# Altium schematic sheet watch_1v1_connector_breakout.SchDoc
size A
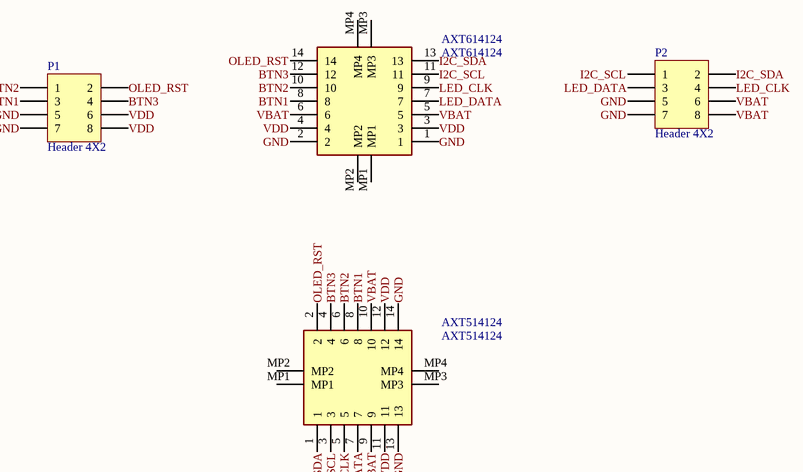
[diagram p0: watch_1v1_connector_breakout.SchDoc]

## Parts
AXT514124  AXT514124  [AXT514124]
AXT614124  AXT614124  [AXT614124]
P1  Header 4X2  [HDR2X4]
P2  Header 4X2  [HDR2X4]

## Nets
BTN1: AXT514124.8 AXT614124.8 P1.3
BTN2: AXT514124.6 AXT614124.10 P1.1
BTN3: AXT514124.4 AXT614124.12 P1.4
GND: AXT514124.13 AXT514124.14 AXT614124.1 AXT614124.2 P1.5 P1.7 P2.5 P2.7
I2C_SCL: AXT514124.3 AXT614124.11 P2.1
I2C_SDA: AXT514124.1 AXT614124.13 P2.2
LED_CLK: AXT514124.5 AXT614124.9 P2.4
LED_DATA: AXT514124.7 AXT614124.7 P2.3
OLED_RST: AXT514124.2 AXT614124.14 P1.2
VBAT: AXT514124.9 AXT514124.10 AXT614124.5 AXT614124.6 P2.6 P2.8
VDD: AXT514124.11 AXT514124.12 AXT614124.3 AXT614124.4 P1.6 P1.8

Not connected (* = marked no-connect by the designer): AXT514124 MP1 MP2 MP3 MP4; AXT614124 MP1 MP2 MP3 MP4

## Library data of the parts
AXT514124 = AXT514124: Connector; Manufacturer_Name: Panasonic; Datasheet Link: https://componentsearchengine.com/Datasheets/1/AXT514124.pdf; Height: 1.17mm; Manufacturer_Part_Number: AXT514124; Mouser Part Number: 769-AXT514124; Mouser Price/Stock: https://www.mouser.com/Search/Refine.aspx?Keyword=769-AXT514124
AXT614124 = AXT614124: Connector; Manufacturer_Name: Panasonic; Datasheet Link: https://componentsearchengine.com/Datasheets/1/AXT614124.pdf; Height: 1.03mm; Manufacturer_Part_Number: AXT614124; Mouser Part Number: 769-AXT614124; Mouser Price/Stock: https://www.mouser.com/Search/Refine.aspx?Keyword=769-AXT614124
P1 P2 = Header 4X2: Header, 4-Pin, Dual row; LatestRevisionDate: 17-Jul-2002; LatestRevisionNote: Re-released for DXP Platform.; Publisher: Altium Limited